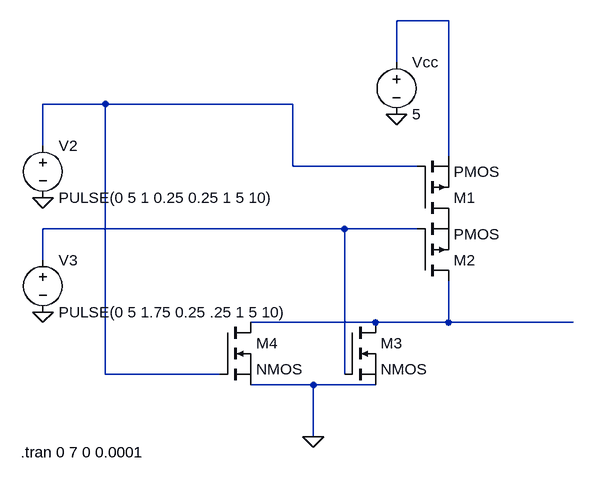
[diagram p0: schematic LTSPICE_NOR_GATE.asc]
LTSPICE_NOR_GATE.asc, the LTspice schematic file:
Version 4
SHEET 1 880 680
WIRE 352 -1024 272 -1024
WIRE 272 -960 272 -1024
WIRE -176 -896 -272 -896
WIRE 112 -896 -176 -896
WIRE -272 -832 -272 -896
WIRE 352 -816 352 -1024
WIRE 112 -800 112 -896
WIRE 304 -800 112 -800
WIRE 192 -704 -272 -704
WIRE 304 -704 192 -704
WIRE -272 -656 -272 -704
WIRE 240 -560 48 -560
WIRE 352 -560 352 -624
WIRE 352 -560 240 -560
WIRE 544 -560 352 -560
WIRE -176 -480 -176 -896
WIRE 0 -480 -176 -480
WIRE 192 -480 192 -704
WIRE 144 -464 48 -464
WIRE 240 -464 144 -464
WIRE 144 -384 144 -464
FLAG -272 -752 0
FLAG -272 -576 0
FLAG 144 -384 0
FLAG 272 -880 0
SYMBOL pmos 304 -720 M180
SYMATTR InstName M1
SYMBOL pmos 304 -624 M180
SYMATTR InstName M2
SYMBOL nmos 192 -560 R0
SYMATTR InstName M3
SYMBOL nmos 0 -560 R0
SYMATTR InstName M4
SYMBOL voltage -272 -848 R0
WINDOW 123 0 0 Left 2
WINDOW 39 0 0 Left 2
SYMATTR InstName V2
SYMATTR Value PULSE(0 5 1 0.25 0.25 1 5 10)
SYMBOL voltage -272 -672 R0
WINDOW 123 0 0 Left 2
WINDOW 39 0 0 Left 2
SYMATTR InstName V3
SYMATTR Value PULSE(0 5 1.75 0.25 .25 1 5 10)
SYMBOL voltage 272 -976 R0
SYMATTR InstName Vcc
SYMATTR Value 5
TEXT -306 -360 Left 2 !.tran 0 7 0 0.0001

The netlist it stands for:
* LTSPICE_NOR_GATE.asc
M1 P001 N002 N001 N001 PMOS
M2 N004 N003 P001 P001 PMOS
M3 N004 N003 0 0 NMOS
M4 N004 N002 0 0 NMOS
V2 N002 0 PULSE(0 5 1 0.25 0.25 1 5 10)
V3 N003 0 PULSE(0 5 1.75 0.25 .25 1 5 10)
Vcc N001 0 5
.model NMOS NMOS
.model PMOS PMOS
.lib standard.mos
.tran 0 7 0 0.0001
.backanno
.end